# EAGLE design untitled (EAGLE 9.6.2)
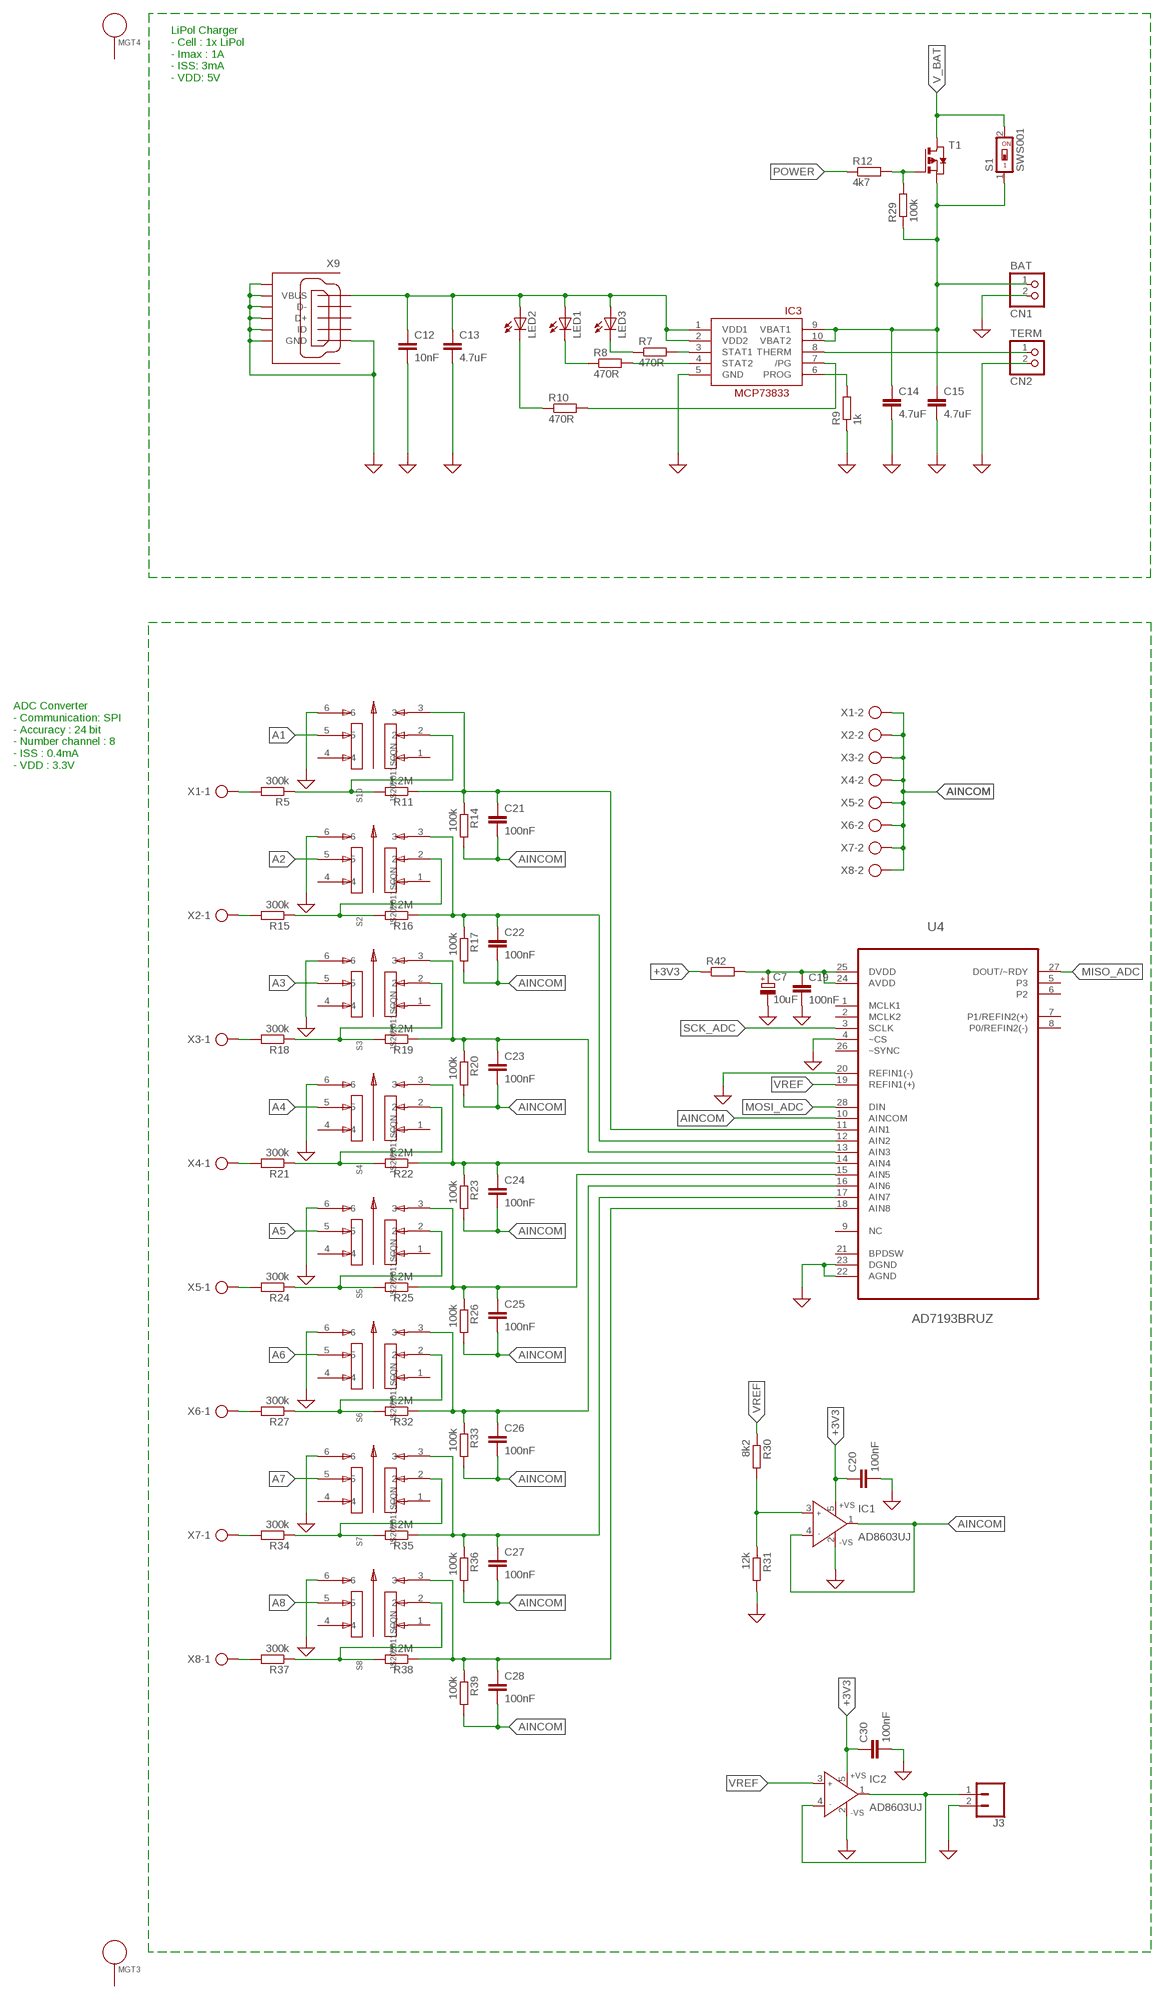
[diagram p0: schematic, sheet 1, part 1 of 2]
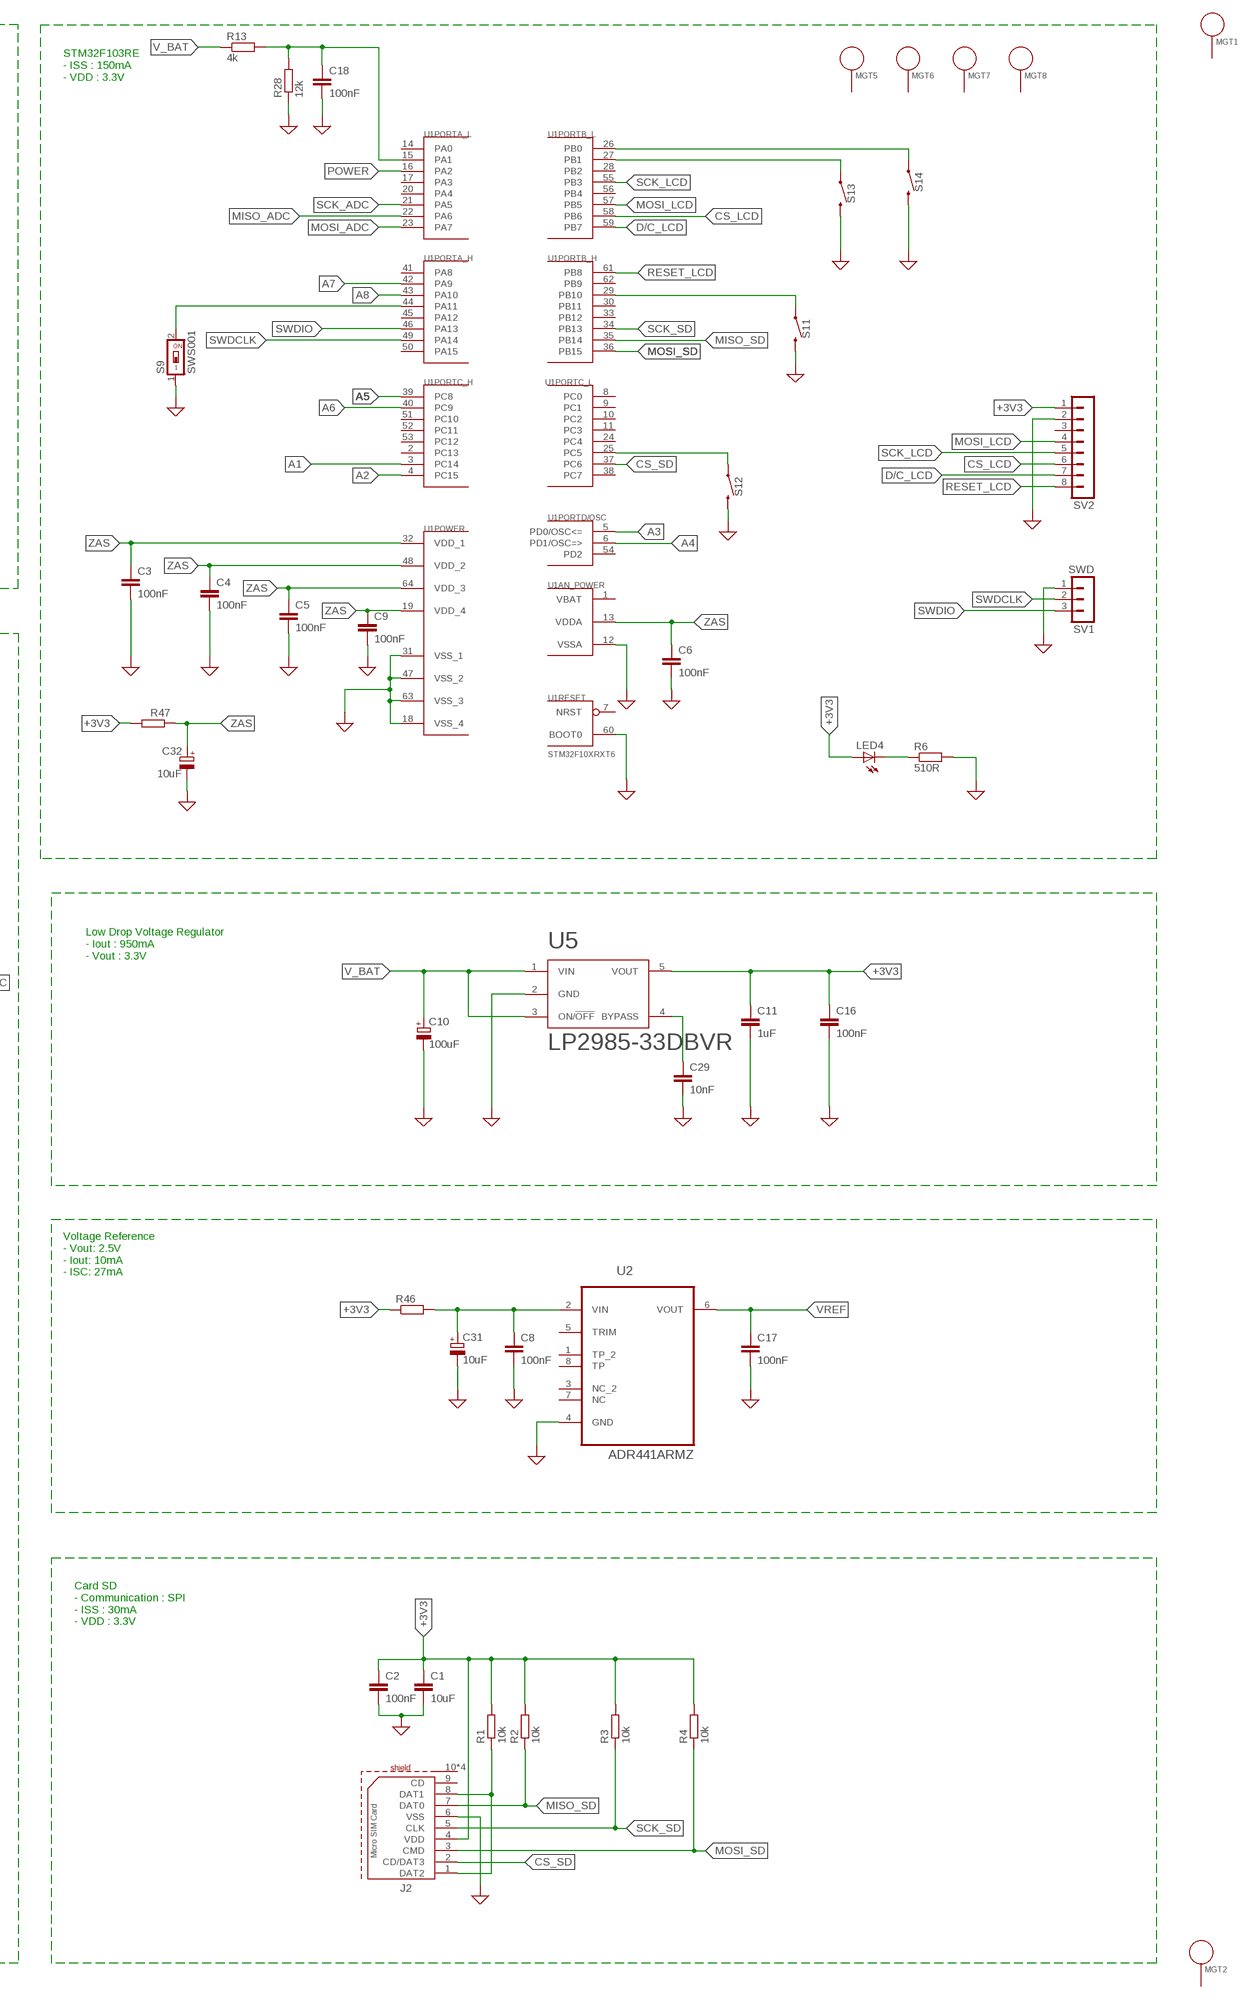
[diagram p1: schematic, sheet 1, part 2 of 2]

## Parts
C1  10uF  C-EUC0805  [C0805]
C2  100nF  C-EUC0805  [C0805]
C3  100nF  C-EUC0805  [C0805]
C4  100nF  C-EUC0805  [C0805]
C5  100nF  C-EUC0805  [C0805]
C6  100nF  C-EUC0805  [C0805]
C7  10uF  CPOL-EUSMCB  [SMC_B]
C8  100nF  C-EUC0805  [C0805]
C9  100nF  C-EUC0805  [C0805]
C10  100uF  CPOL-EUSMCB  [SMC_B]
C11  1uF  C-EUC0805  [C0805]
C12  10nF  C-EUC0805  [C0805]
C13  4.7uF  C-EUC0805  [C0805]
C14  4.7uF  C-EUC0805  [C0805]
C15  4.7uF  C-EUC0805  [C0805]
C16  100nF  C-EUC0805  [C0805]
C17  100nF  C-EUC0805  [C0805]
C18  100nF  C-EUC0805  [C0805]
C19  100nF  C-EUC0805  [C0805]
C20  100nF  C-EUC0805  [C0805]
C21  100nF  C-EUC0805  [C0805]
C22  100nF  C-EUC0805  [C0805]
C23  100nF  C-EUC0805  [C0805]
C24  100nF  C-EUC0805  [C0805]
C25  100nF  C-EUC0805  [C0805]
C26  100nF  C-EUC0805  [C0805]
C27  100nF  C-EUC0805  [C0805]
C28  100nF  C-EUC0805  [C0805]
C29  10nF  C-EUC0805  [C0805]
C30  100nF  C-EUC0805  [C0805]
C31  10uF  CPOL-EUSMCB  [SMC_B]
C32  10uF  CPOL-EUSMCB  [SMC_B]
CN1  BAT  JST_2PIN-THM-RA  [JST-PH-2-THM-RA]
CN2  TERM  JST_2PIN-THM-RA  [JST-PH-2-THM-RA]
IC1  AD8603UJ  [SOT23-5]
IC2  AD8603UJ  [SOT23-5]
IC3  MCP73833-UN  [MSOP10]
J2  693071020811  [693071020811]
J3  CONN_02PTH3  [1X02_LONGPADS]
LED1  LEDCHIP-LED0805  [CHIP-LED0805]
LED2  LEDCHIP-LED0805  [CHIP-LED0805]
LED3  LEDCHIP-LED0805  [CHIP-LED0805]
LED4  LEDCHIP-LED0805  [CHIP-LED0805]
MGT1  MOUNTING_HOLE  [BEAGLEBONEBLACK_MOUNTING_HOLE]
MGT2  MOUNTING_HOLE  [BEAGLEBONEBLACK_MOUNTING_HOLE]
MGT3  MOUNTING_HOLE  [BEAGLEBONEBLACK_MOUNTING_HOLE]
MGT4  MOUNTING_HOLE  [BEAGLEBONEBLACK_MOUNTING_HOLE]
MGT5  MOUNTING_HOLE  [BEAGLEBONEBLACK_MOUNTING_HOLE]
MGT6  MOUNTING_HOLE  [BEAGLEBONEBLACK_MOUNTING_HOLE]
MGT7  MOUNTING_HOLE  [BEAGLEBONEBLACK_MOUNTING_HOLE]
MGT8  MOUNTING_HOLE  [BEAGLEBONEBLACK_MOUNTING_HOLE]
R1  10k  R-EU_R0805  [R0805]
R2  10k  R-EU_R0805  [R0805]
R3  10k  R-EU_R0805  [R0805]
R4  10k  R-EU_R0805  [R0805]
R5  300k  R-EU_R0805  [R0805]
R6  510R  R-EU_R0805  [R0805]
R7  470R  R-EU_R0805  [R0805]
R8  470R  R-EU_R0805  [R0805]
R9  1k  R-EU_R0805  [R0805]
R10  470R  R-EU_R0805  [R0805]
R11  1.2M  R-EU_R0805  [R0805]
R12  4k7  R-EU_R0805  [R0805]
R13  4k  R-EU_R0805  [R0805]
R14  100k  R-EU_R0805  [R0805]
R15  300k  R-EU_R0805  [R0805]
R16  1.2M  R-EU_R0805  [R0805]
R17  100k  R-EU_R0805  [R0805]
R18  300k  R-EU_R0805  [R0805]
R19  1.2M  R-EU_R0805  [R0805]
R20  100k  R-EU_R0805  [R0805]
R21  300k  R-EU_R0805  [R0805]
R22  1.2M  R-EU_R0805  [R0805]
R23  100k  R-EU_R0805  [R0805]
R24  300k  R-EU_R0805  [R0805]
R25  1.2M  R-EU_R0805  [R0805]
R26  100k  R-EU_R0805  [R0805]
R27  300k  R-EU_R0805  [R0805]
R28  12k  R-EU_R0805  [R0805]
R29  100k  R-EU_R0805  [R0805]
R30  8k2  R-EU_R0805  [R0805]
R31  12k  R-EU_R0805  [R0805]
R32  1.2M  R-EU_R0805  [R0805]
R33  100k  R-EU_R0805  [R0805]
R34  300k  R-EU_R0805  [R0805]
R35  1.2M  R-EU_R0805  [R0805]
R36  100k  R-EU_R0805  [R0805]
R37  300k  R-EU_R0805  [R0805]
R38  1.2M  R-EU_R0805  [R0805]
R39  100k  R-EU_R0805  [R0805]
R42  R-EU_R1206  [R1206]
R46  R-EU_R1206  [R1206]
R47  R-EU_R1206  [R1206]
S1  SWS001  [SMS-001]
S2  JS202011SCQN  [SW_JS202011SCQN]
S3  JS202011SCQN  [SW_JS202011SCQN]
S4  JS202011SCQN  [SW_JS202011SCQN]
S5  JS202011SCQN  [SW_JS202011SCQN]
S6  JS202011SCQN  [SW_JS202011SCQN]
S7  JS202011SCQN  [SW_JS202011SCQN]
S8  JS202011SCQN  [SW_JS202011SCQN]
S9  SWS001  [SMS-001]
S10  JS202011SCQN  [SW_JS202011SCQN]
S11  MOMENTARY-SWITCH-SPST-SMD-6.2MM-TALL  [TACTILE_SWITCH_SMD_6.2MM_TALL]
S12  MOMENTARY-SWITCH-SPST-SMD-6.2MM-TALL  [TACTILE_SWITCH_SMD_6.2MM_TALL]
S13  MOMENTARY-SWITCH-SPST-SMD-6.2MM-TALL  [TACTILE_SWITCH_SMD_6.2MM_TALL]
S14  MOMENTARY-SWITCH-SPST-SMD-6.2MM-TALL  [TACTILE_SWITCH_SMD_6.2MM_TALL]
SV1  SWD  MA03-1  [MA03-1]
SV2  MA08-1  [MA08-1]
T1  PMOSSOT223  [SOT223]
U1  STM32F10XRXT6  [TQFP64]
U2  ADR441ARMZ  [SOP65P490X110-8N]
U4  AD7193BRUZ  [SOP65P640X120-28N]
U5  LP2985-33DBVR  [SOT-23-5]
X1  AK300/2  [AK300/2]
X2  AK300/2  [AK300/2]
X3  AK300/2  [AK300/2]
X4  AK300/2  [AK300/2]
X5  AK300/2  [AK300/2]
X6  AK300/2  [AK300/2]
X7  AK300/2  [AK300/2]
X8  AK300/2  [AK300/2]
X9  GHI-CONNECTORS_10118192-0001LF  [GHI-CONNECTORS_10118192-0001LF(MICRO-USB-B-AMPHENOL-FCI)]

## Nets
+3V3: C1.1 C2.1 C11.1 C16.1 C20.1 C30.1 IC1.5(+VS) IC2.5(+VS) J2.4(VDD) LED4.A R1.2 R2.2 R3.2 R4.2 R42.1 R46.1 R47.2 SV2.1 U5.5(VOUT)
A1: S10.5 U1.3(PORTC_H:PC14)
A2: S2.5 U1.4(PORTC_H:PC15)
A3: S3.5 U1.5(PORTD/OSC:PD0/OSC<=)
A4: S4.5 U1.6(PORTD/OSC:PD1/OSC=>)
A5: S5.5 U1.39(PORTC_H:PC8)
A6: S6.5 U1.40(PORTC_H:PC9)
A7: S7.5 U1.42(PORTA_H:PA9)
A8: S8.5 U1.43(PORTA_H:PA10)
AINCOM: C21.2 C22.2 C23.2 C24.2 C25.2 C26.2 C27.2 C28.2 IC1.1(OUT) IC1.4(IN-) R14.2 R17.2 R20.2 R23.2 R26.2 R33.2 R36.2 R39.2 U4.10(AINCOM) X1.2 X2.2 X3.2 X4.2 X5.2 X6.2 X7.2 X8.2
CS_LCD: SV2.6 U1.58(PORTB_L:PB6)
CS_SD: J2.2(CD/DAT3) U1.37(PORTC_L:PC6)
D/C_LCD: SV2.7 U1.59(PORTB_L:PB7)
GND: C1.2 C2.2 C3.2 C4.2 C5.2 C6.2 C7.- C8.2 C9.2 C10.- C11.2 C12.2 C13.2 C14.2 C15.2 C16.2 C17.2 C18.2 C19.2 C20.2 C29.2 C30.2 C31.- C32.- CN1.2 CN2.2 IC1.2(-VS) IC2.2(-VS) IC3.5(GND) J2.6(VSS) J3.2 R6.2 R9.1 R28.1 R31.2 S2.6 S3.6 S4.6 S5.6 S6.6 S7.6 S8.6 S9.1 S10.6 S11.B2 S12.B2 S13.B2 S14.B2 SV1.1 SV2.2 U1.12(AN_POWER:VSSA) U1.18(POWER:VSS_4) U1.31(POWER:VSS_1) U1.47(POWER:VSS_2) U1.60(RESET:BOOT0) U1.63(POWER:VSS_3) U2.4(GND) U4.4(~CS) U4.20(REFIN1(-)) U4.22(AGND) U4.23(DGND) U5.2(GND) X9.CGND1(SGND1) X9.CGND2(SGND2) X9.CGND3(SGND3) X9.CGND4(SGND4) X9.CGND5(SGND5) X9.CGND6(SGND6) X9.GND ; supply symbol labelled SUP
MISO_ADC: U1.22(PORTA_L:PA6) U4.27(DOUT/~RDY)
MISO_SD: J2.7(DAT0) R2.1 U1.35(PORTB_H:PB14)
MOSI_ADC: U1.23(PORTA_L:PA7) U4.28(DIN)
MOSI_LCD: SV2.4 U1.57(PORTB_L:PB5)
MOSI_SD: J2.3(CMD) R4.1 U1.36(PORTB_H:PB15)
N$1: J2.1(DAT2) J2.8(DAT1) R1.1
N$3: LED4.C R6.1
N$4: C22.1 R16.1 R17.1 S2.3 U4.12(AIN2)
N$5: R5.2 X1.1
N$8: IC3.3(STAT1) R7.2
N$9: IC3.6(PROG) R9.2
N$10: IC3.7(/PG) R10.2
N$11: LED3.C R7.1
N$12: LED1.C R8.1
N$13: IC3.4(STAT2) R8.2
N$14: LED2.C R10.1
N$15: CN2.1 IC3.8(THERM)
N$16: C12.1 C13.1 IC3.1(VDD1) IC3.2(VDD2) LED1.A LED2.A LED3.A X9.VBUS
N$17: C21.1 R11.1 R14.1 S10.3 U4.11(AIN1)
N$18: R15.1 R16.2 S2.2
N$19: C29.1 U5.4(BYPASS)
N$20: R5.1 R11.2 S10.2
N$21: R21.1 R22.2 S4.2
N$22: C26.1 R32.1 R33.1 S6.3 U4.16(AIN6)
N$23: C27.1 R35.1 R36.1 S7.3 U4.17(AIN7)
N$24: R15.2 X2.1
N$25: C18.1 R13.2 R28.2 U1.15(PORTA_L:PA1)
N$29: C23.1 R19.1 R20.1 S3.3 U4.13(AIN3)
N$30: IC2.1(OUT) IC2.4(IN-) J3.1
N$31: C7.+ C19.1 R42.2 U4.24(AVDD) U4.25(DVDD)
N$32: R18.2 X3.1
N$33: C14.1 C15.1 CN1.1 IC3.9(VBAT1) IC3.10(VBAT2) R29.1 S1.1 T1.3(S)
N$34: R18.1 R19.2 S3.2
N$35: IC1.3(IN+) R30.2 R31.1
N$36: S11.A2 U1.29(PORTB_H:PB10)
N$37: C24.1 R22.1 R23.1 S4.3 U4.14(AIN4)
N$39: C25.1 R25.1 R26.1 S5.3 U4.15(AIN5)
N$40: R21.2 X4.1
N$43: S14.A2 U1.26(PORTB_L:PB0)
N$44: R24.2 X5.1
N$46: R24.1 R25.2 S5.2
N$47: S13.A2 U1.27(PORTB_L:PB1)
N$48: R12.2 R29.2 T1.1(G)
N$49: S9.2 U1.44(PORTA_H:PA11)
N$50: R27.2 X6.1
N$51: R27.1 R32.2 S6.2
N$52: S12.A2 U1.25(PORTC_L:PC5)
N$54: R34.2 X7.1
N$55: R34.1 R35.2 S7.2
N$56: C28.1 R38.1 R39.1 S8.3 U4.18(AIN8)
N$58: R37.2 X8.1
N$59: R37.1 R38.2 S8.2
N$60: C8.1 C31.+ R46.2 U2.2(VIN)
POWER: R12.1 U1.16(PORTA_L:PA2)
RESET_LCD: SV2.8 U1.61(PORTB_H:PB8)
SCK_ADC: U1.21(PORTA_L:PA5) U4.3(SCLK)
SCK_LCD: SV2.5 U1.55(PORTB_L:PB3)
SCK_SD: J2.5(CLK) R3.1 U1.34(PORTB_H:PB13)
SWDCLK: SV1.2 U1.49(PORTA_H:PA14)
SWDIO: SV1.3 U1.46(PORTA_H:PA13)
V_BAT: C10.+ R13.1 S1.2 T1.2(D) T1.4(D) U5.1(VIN) U5.3(ON/!OFF!)
VREF: C17.1 IC2.3(IN+) R30.1 U2.6(VOUT) U4.19(REFIN1(+))
ZAS: C3.1 C4.1 C5.1 C6.1 C9.1 C32.+ R47.1 U1.13(AN_POWER:VDDA) U1.19(POWER:VDD_4) U1.32(POWER:VDD_1) U1.48(POWER:VDD_2) U1.64(POWER:VDD_3)
Unconnected: J2.9(CD) J2.10(SHIELD) J2.11(SHIELD) J2.12(SHIELD) J2.13(SHIELD) MGT1.P$1 MGT2.P$1 MGT3.P$1 MGT4.P$1 MGT5.P$1 MGT6.P$1 MGT7.P$1 MGT8.P$1 S2.1 S2.4 S3.1 S3.4 S4.1 S4.4 S5.1 S5.4 S6.1 S6.4 S7.1 S7.4 S8.1 S8.4 S10.1 S10.4 SV2.3 U1.2(PORTC_H:PC13) U1.7(RESET:NRST) U1.8(PORTC_L:PC0) U1.9(PORTC_L:PC1) U1.10(PORTC_L:PC2) U1.11(PORTC_L:PC3) U1.14(PORTA_L:PA0) U1.17(PORTA_L:PA3) U1.20(PORTA_L:PA4) U1.24(PORTC_L:PC4) U1.28(PORTB_L:PB2) U1.30(PORTB_H:PB11) U1.33(PORTB_H:PB12) U1.38(PORTC_L:PC7) U1.41(PORTA_H:PA8) U1.45(PORTA_H:PA12) U1.50(PORTA_H:PA15) U1.51(PORTC_H:PC10) U1.52(PORTC_H:PC11) U1.53(PORTC_H:PC12) U1.54(PORTD/OSC:PD2) U1.56(PORTB_L:PB4) U1.62(PORTB_H:PB9) U2.1(TP_2) U2.3(NC_2) U2.5(TRIM) U2.7(NC) U2.8(TP) U4.1(MCLK1) U4.2(MCLK2) U4.5(P3) U4.6(P2) U4.7(P1/REFIN2(+)) U4.8(P0/REFIN2(-)) U4.9(NC) U4.21(BPDSW) U4.26(~SYNC) X9.D+ X9.D- X9.ID

## Notes on the sheet
- STM32F103RE
  - ISS : 150mA
  - VDD : 3.3V
- LiPol Charger
  - Cell : 1x LiPol
  - Imax : 1A
  - ISS: 3mA
  - VDD: 5V
- ADC Converter
  - Communication: SPI
  - Accuracy : 24 bit
  - Number channel : 8
  - ISS : 0.4mA
  - VDD : 3.3V
- Low Drop Voltage Regulator
  - Iout : 950mA
  - Vout : 3.3V
- Voltage Reference
  - Vout: 2.5V
  - Iout: 10mA
  - ISC: 27mA
- Card SD
  - Communication : SPI
  - ISS : 30mA
  - VDD : 3.3V

## Power pins joined to a net without a drawn wire
VBAT: U1.1(AN_POWER:VBAT)

## Library data of the parts
C1-C6 C8 C9 C11-C30 = rcl:C-EU: CAPACITOR, European symbol; SPICEPREFIX: C
C7 C10 C31 C32 = rcl:CPOL-EU: POLARIZED CAPACITOR, European symbol; SPICEPREFIX: C
CN1 CN2 = adafruit:JST_2PIN: JST 2-Pin Connectors of various flavors SMT-RA (S2B-PH-SM4) 4UConnector #17311 SMT (B2B-PH-SM4) THM-RA (S2B-PH) THM (B2B-PH)
IC1 IC2 = analog-devices:AD8603: Precision Micropower, Low Noise CMOS, Rail-to-Rail Input/Output Operational Amplifiers Source: http://www.analog.com/static/imported-files/data_sheets/AD8603_8607_8609.pdf; MF: ALTERA CORPORATION; MPN: AD8603AUJZ-REEL7; OC_FARNELL: 1651290; OC_NEWARK: 59K6904
IC3 = adafruit:MCP73833
J2 = Wurth_Connectors_WR-CRD:693071020811: WR-CRD Micro SD Card Connector Push & Push 8 pins KIND PROPERTIES Quality Class 10 000 Mating cycles Gender Socket Type Push & Push MATERIAL PROPERTIES Insulator Material LCP Insulator Flammability Rating UL94 V-0 Insulator Color Black Color Black Cover Material Stainless Steel Contact Material Copper Alloy Contact Plating Selective Gold;​ 1 u' on contact area Contact Type Stamped GENERAL INFORMATION Operating Temperature -25 up to +85 °C;​ -40 up to +85 °C Compliance RoHS ELECTRICAL PROPERTIES Working Voltage 100 V (AC);​ 30 V (AC) Withstanding Voltage 500 V (AC) Contact Resistance 100 mΩ Contact Resistance 500 mΩ Details see: https://katalog.we-online.com/en/em/CRD_SD_MICRO_PUSH_AND_PULL_8_PINS Created by Ella Wu 2019-11-05 2019(C) Wurth Elektronik; DATASHEET-URL: https://www.we-online.com/catalog/datasheet/693071020811.pdf; GERDER: Socket; MOUNT: SMT; PART-NUMBER: 693071020811; PINS: 8; TYPE: Push & Push
J3 = SparkFun-Connectors:CONN_02: Multi connection point. Often used as Generic Header-pin footprint for 0.1 inch spaced/style header connections On any of the 0.1 inch spaced packages, you can populate with these: Break Away Headers - Straight <https://www.sparkfun.com/products/116> (PRT-00116) Break Away Male Headers - Right Angle <https://www.sparkfun.com/products/553> (PRT-00553) Female Headers <https://www.sparkfun.com/products/115> (PRT-00115) Break Away Headers - Machine Pin <https://www.sparkfun.com/products/117> (PRT-00117) Break Away Female Headers - Swiss Machine Pin <https://www.sparkfun.com/products/743> (PRT-00743) For SCREWTERMINALS and SPRING TERMINALS visit here: Screw Terimnals on SparkFun.com <https://www.sparkfun.com/search/results?term=Screw+Terminals> (5mm/3.5mm/2.54mm spacing) This device is also useful as a general connection point to wire up your design to another part of your project. Our various solder wires solder well into these plated through hole pads. Hook-Up Wire - Assortment (Stranded, 22 AWG) <https://www.sparkfun.com/products/11375> (PRT-11375) Hook-Up Wire - Assortment (Solid Core, 22 AWG) <https://www.sparkfun.com/products/11367> (PRT-11367) View the entire wire category on our website here <https://www.sparkfun.com/categories/141> Special notes: Molex polarized connector foot print use with: PRT-08233 with associated crimp pins and housings. 2.54_SCREWTERM for use with PRT-10571. 3.5mm Screw Terminal footprints for PRT-08084 5mm Screw Terminal footprints for use with PRT-08432
LED1-LED4 = adafruit:LED: LED OSRAM: - CHIPLED LG R971, LG N971, LY N971, LG Q971, LY Q971, LO R971, LY R971 LH N974, LH R974 LS Q976, LO Q976, LY Q976 LO Q996 - Hyper CHIPLED LW Q18S LB Q993, LB Q99A, LB R99A - SideLED LS A670, LO A670, LY A670, LG A670, LP A670 LB A673, LV A673, LT A673, LW A673 LH A674 LY A675 LS A676, LA A676, LO A676, LY A676, LW A676 LS A679, LY A679, LG A679 - Hyper Micro SIDELED® LS Y876, LA Y876, LO Y876, LY Y876 LT Y87S - SmartLED LW L88C, LW L88S LB L89C, LB L89S, LG L890 LS L89K, LO L89K, LY L89K LS L896, LA L896, LO L896, LY L896 - TOPLED LS T670, LO T670, LY T670, LG T670, LP T670 LSG T670, LSP T670, LSY T670, LOP T670, LYG T670 LG T671, LOG T671, LSG T671 LB T673, LV T673, LT T673, LW T673 LH T674 LS T676, LA T676, LO T676, LY T676, LB T676, LH T676, LSB T676, LW T676 LB T67C, LV T67C, LT T67C, LS T67K, LO T67K, LY T67K, LW E67C LS E67B, LA E67B, LO E67B, LY E67B, LB E67C, LV E67C, LT E67C LW T67C LS T679, LY T679, LG T679 LS T770, LO T770, LY T770, LG T770, LP T770 LB T773, LV T773, LT T773, LW T773 LH T774 LS E675, LA E675, LY E675, LS T675 LS T776, LA T776, LO T776, LY T776, LB T776 LHGB T686 LT T68C, LB T68C - Hyper Mini TOPLED® LB M676 - Mini TOPLED Santana® LG M470 LS M47K, LO M47K, LY M47K Source: http://www.osram.convergy.de/
MGT1-MGT8 = BeagleBone_Blue_R3:MOUNTING_HOLE: Chassis Mounting Hole w/GND connection ability
R1-R39 R42 R46 R47 = rcl:R-EU_: RESISTOR, European symbol; SPICEPREFIX: R
S1 S9 = smd-special:SWS001: SMD Dip Switch 1 pol.
S2-S8 S10 = JS202011SCQN:JS202011SCQN: JS Series DPDT On-On Gull Wing Surface Mount Subminiature Slide Switch Check prices <https://pricing.snapeda.com/parts/JS202011SCQN/C%26K/view-part?ref=eda>; AVAILABILITY: Good; DESCRIPTION: Slide Switch DPDT Surface Mount; MF: C&K; MP: JS202011SCQN; PACKAGE: None; PRICE: None; PURCHASE-URL: https://pricing.snapeda.com/search/part/JS202011SCQN/?ref=eda
S11-S14 = SparkFun-Switches:MOMENTARY-SWITCH-SPST: Momentary Switch (Pushbutton) - SPST Normally-open (NO) SPST momentary switches (buttons, pushbuttons). Variants PTH-12MM - 12mm square, through-hole Momentary Pushbutton Switch - 12mm Square <https://www.sparkfun.com/products/9190> (COM-09190) PTH-6.0MM, PTH-6.0MM-KIT - 6.0mm square, through-hole Mini Pushbutton Switch <https://www.sparkfun.com/products/97> (COM-00097) KIT package intended for soldering kit's - only one side of pads' copper is exposed. PTH-RIGHT-ANGLE-KIT - Right-angle, through-hole Right Angle Tactile Button <https://www.sparkfun.com/products/10791> - Used on SparkFun BigTime Watch Kit <https://www.sparkfun.com/products/11734> SMD-12MM - 12mm square, surface-mount Tactile Button - SMD (12mm) <https://www.sparkfun.com/products/12993> (COM-12993) Used on SparkFun PicoBoard <https://www.sparkfun.com/products/11888> SMD-4.5MM - 4.5mm Square Trackball Switch Used on SparkFun Blackberry Trackballer Breakout <https://www.sparkfun.com/products/13169> SMD-4.6MMX2.8MM - 4.60mm x 2.80mm, surface mount Used on SparkFun SAMD21 Mini Breakout <https://www.sparkfun.com/products/13664> SMD-5.2MM, SMD-5.2-REDUNDANT - 5.2mm square, surface-mount Mini Pushbutton Switch - SMD <https://www.sparkfun.com/products/8720> (COM-08720) Used on Arduino Pro Mini <https://www.sparkfun.com/products/11114> REDUNDANT package connects both switch circuits together SMD-6.0X3.5MM - 6.0 x 3.5mm, surface mount Momentary Reset Switch SMD <https://www.sparkfun.com/products/8229> (COM-08229) SMD-6.2MM-TALL - 6.2mm square, surface mount Tactile Button - SMD (6mm) <https://www.sparkfun.com/products/12992> Used on SparkFun Digital Sandbox <https://www.sparkfun.com/products/12651> SMD-RIGHT-ANGLE - Right-angle, surface mount Used on SparkFun Block for Intel® Edison - Arduino <https://www.sparkfun.com/products/13036>; PROD_ID: SWCH-11966; SF_SKU: COM-12992
SV1 = con-lstb:MA03-1: PIN HEADER; OC_FARNELL: unknown; OC_NEWARK: unknown
SV2 = con-lstb:MA08-1: PIN HEADER; OC_FARNELL: unknown; OC_NEWARK: unknown
T1 = zetex:PMOSSOT223: MOS FET; OC_FARNELL: unknown; OC_NEWARK: unknown
U1 = stm32:STM32F10XRXT6: STM32F101/103 64pin LQFP
U2 = ADR441ARMZ:ADR441ARMZ: Ultralow Noise, LDO XFET Voltage Check prices <https://pricing.snapeda.com/parts/ADR441ARMZ/Analog%20Devices/view-part?ref=eda>; AVAILABILITY: Warning; DESCRIPTION: Series Voltage Reference IC ±0.12% 8-MSOP; MF: Analog Devices; MP: ADR441ARMZ; PACKAGE: MSOP-8 Analog Devices; PRICE: None; PURCHASE-URL: https://pricing.snapeda.com/search/part/ADR441ARMZ/?ref=eda
U4 = AD7193BRUZ:AD7193BRUZ: 4-Channel, 4.8 kHz, Ultralow Noise, 24-Bit Sigma-Delta ADC with PGA Check prices <https://pricing.snapeda.com/parts/AD7193BRUZ/Analog%20Devices/view-part?ref=eda>; AVAILABILITY: Good; DESCRIPTION: 24 Bit Analog to Digital Converter 4, 8 Input 1 Sigma-Delta 28-TSSOP; MF: Analog Devices; MP: AD7193BRUZ; PACKAGE: TSSOP -28 Analog Devices; PRICE: None; PURCHASE-URL: https://pricing.snapeda.com/search/part/AD7193BRUZ/?ref=eda
U5 = IC:LP2985-33DBVR: IC REG LINEAR 3.3V 150MA SOT23-5 Manufacturer's datasheet <http://www.ti.com/lit/ds/symlink/lp2985.pdf>; CREATED_BY: PCBLayout.com; DIGIKEY_PART_NUMBER: 296-18476-2-ND; MANUFACTURER: Texas Instruments; MPN: LP2985-33DBVR; PACKAGE: SOT-23-5
X1-X8 = con-ptr500:AK300/2: CONNECTOR; OC_FARNELL: unknown; OC_NEWARK: unknown
X9 = BeagleBone_Black_Wireless:GHI-CONNECTORS_10118192-0001LF: Amphenol FCI Micro USB Type B Complete Surface Mount (SMT) no guide holes

## Board
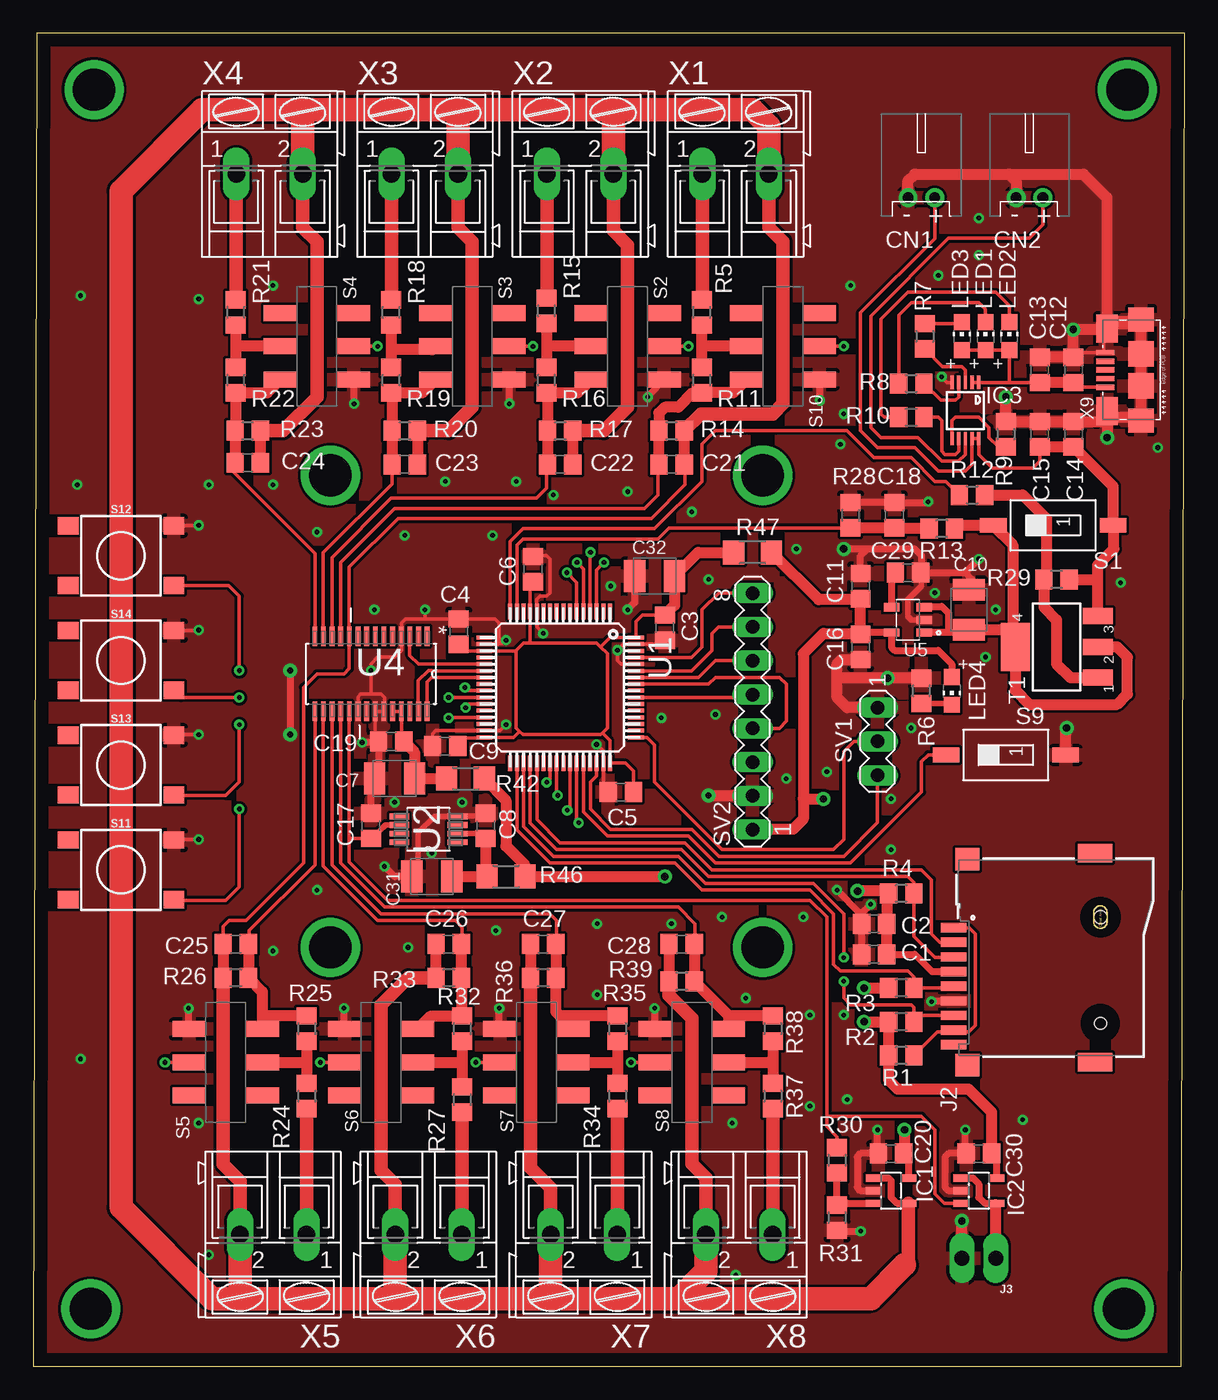
[diagram p2: board, top side]
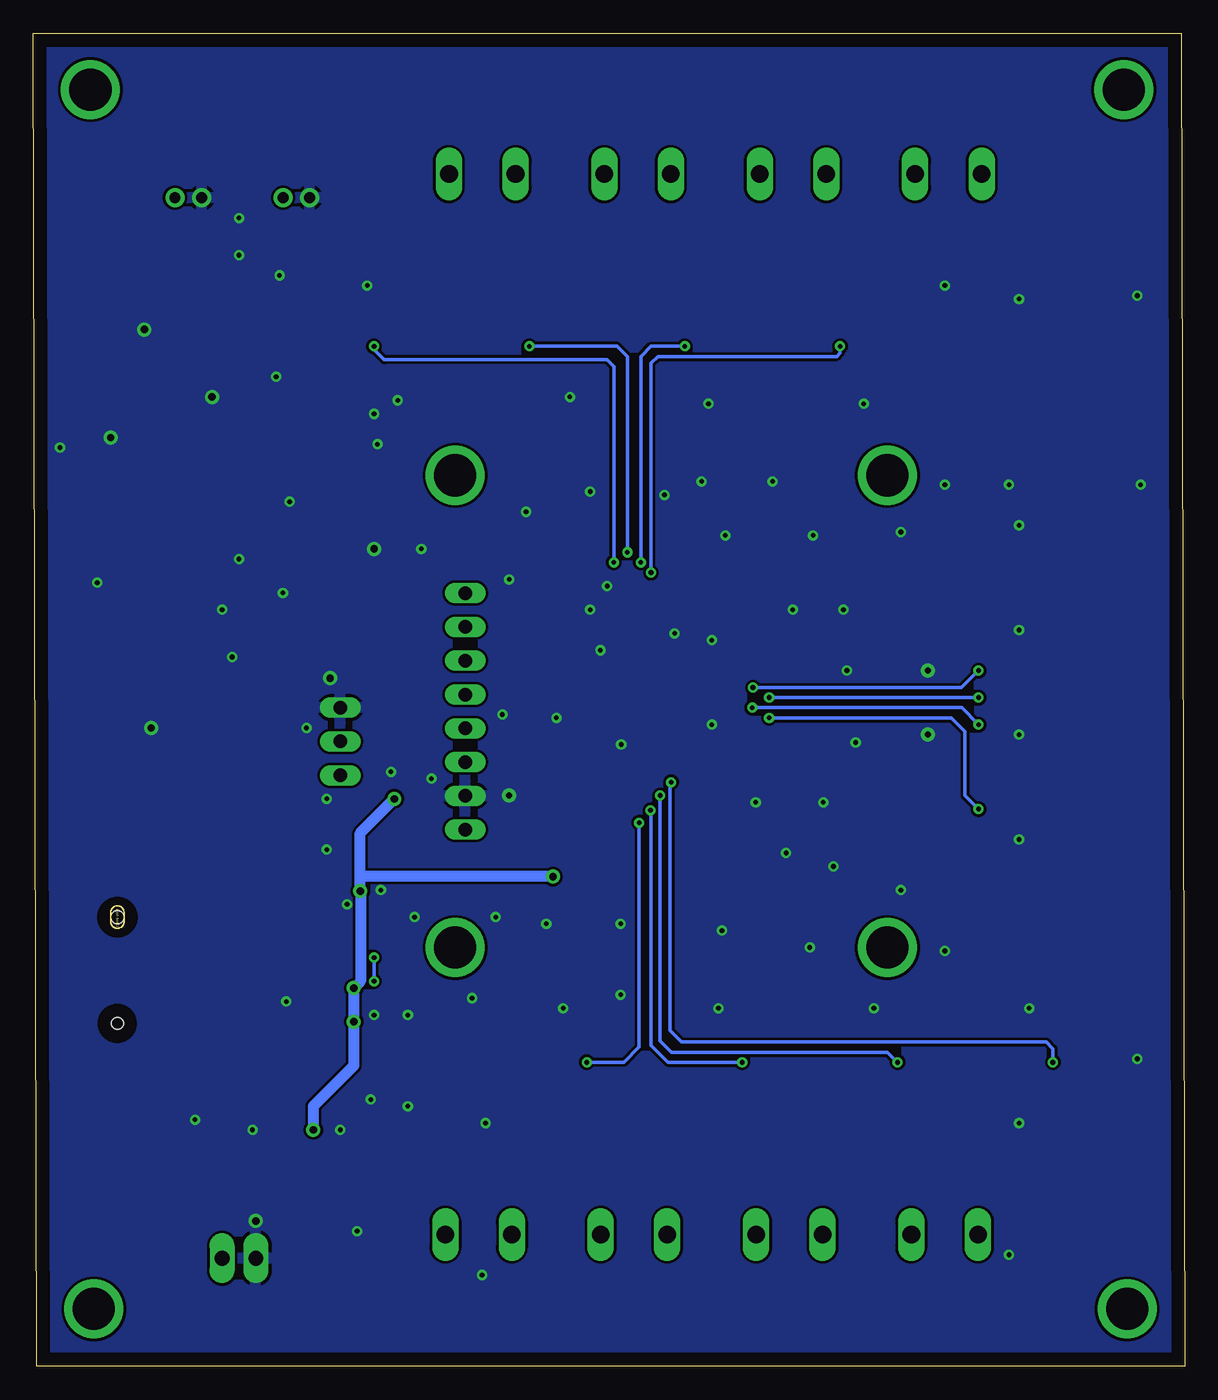
[diagram p3: board, bottom side, seen from below]

Size 86.59 x 100.25 mm. Coordinates in mm from the lower left corner, seen from the top.
Outline: 0,0 86.34,0 86.59,100.25 0.25,100.25 0,0
Copper layers (1*16): Top 0.035mm / dielectric 1.5mm / Bottom 0.035mm
Design rules "default *": minimum track width 8mil, minimum drill 0.35mm, track to track 8mil, track to pad 8mil, pad to pad 6mil, via to via 6mil, smd to smd 6mil, copper to edge 40mil, drill to drill 6mil, minimum pad ring 10mil, minimum via ring 8mil, stop-mask expansion 4mil, vias tented up to drill 0mil, thermal gap 10mil

### Footprints (pad centres in the part's own frame; a part is rotated, then mirrored left to right if it is on the bottom)
C0805 = smd 1.3 x 1.5: 1 -0.95,0; 2 0.95,0
SMC_B = smd 1.6 x 2.4: + -1.5,0; - 1.5,0
JST-PH-2-THM-RA = drill 0.8 pad 1.422: 1 1,0; 2 -1,0
SOT23-5 = smd 0.55 x 1.2: 1 -0.95,-1.3; 2 0,-1.3; 3 0.95,-1.3; 4 0.95,1.3; 5 -0.95,1.3
MSOP10 = smd 0.25 x 1: 1 -1,-2.113; 2 -0.5,-2.113; 3 0,-2.113; 4 0.5,-2.113; 5 1,-2.113; 6 1,2.113; 7 0.5,2.113; 8 0,2.113; 9 -0.5,2.113; 10 -1,2.113
693071020811 = smd 0.7 x 1.9: 1 2.25,11.05; 2 1.15,11.05; 3 0.05,11.05; 4 -1.05,11.05; 5 -2.15,11.05; 6 -3.25,11.05; 7 -4.35,11.05; 8 -5.45,11.05; 9 -6.55,11.05 | smd 1.7 x 1.8: 10 -8.1,10; 11 7.4,10 | smd 1.4 x 2.6: 12 -7.85,0.4; 13 7.85,0.4 | hole 0.9: -4.95,0 | hole 1: 3.05,0
1X02_LONGPADS = drill 1.118 pad 1.88 long: 1 0,0; 2 2.54,0
CHIP-LED0805 = smd 1.2 x 1.2: A 0,-1.05; C 0,1.05
BEAGLEBONEBLACK_MOUNTING_HOLE = drill 3.175 pad 4.445: P$1 0,0
R0805 = smd 1.3 x 1.5: 1 -0.95,0; 2 0.95,0
R1206 = smd 1.6 x 1.803: 1 -1.422,0; 2 1.422,0
SMS-001 = smd 1.092 x 2.007: 1 0,-4.496; 2 0,4.496
SW_JS202011SCQN = smd 1.2 x 2.5: 1 -2.5,-2.75; 2 0,-2.75; 3 2.5,-2.75; 4 -2.5,2.75; 5 0,2.75; 6 2.5,2.75
TACTILE_SWITCH_SMD_6.2MM_TALL = smd 1.55 x 1.3: A1 -3.975,-2.25; A2 3.975,-2.25; B1 -3.975,2.25; B2 3.975,2.25
MA03-1 = drill 1.016 long: 1 -2.54,0; 2 0,0; 3 2.54,0
MA08-1 = drill 1.016 long: 1 -8.89,0; 2 -6.35,0; 3 -3.81,0; 4 -1.27,0; 5 1.27,0; 6 3.81,0; 7 6.35,0; 8 8.89,0
SOT223 = smd 1.219 x 2.235: 1 -2.311,-3.099; 2 0,-3.099; 3 2.311,-3.099 | smd 3.6 x 2.2: 4 0,3.099
TQFP64 = smd 1.2 x 0.3: 1 -5.7,3.75; 2 -5.7,3.25; 3 -5.7,2.75; 4 -5.7,2.25; 5 -5.7,1.75; 6 -5.7,1.25; 7 -5.7,0.75; 8 -5.7,0.25; 9 -5.7,-0.25; 10 -5.7,-0.75; 11 -5.7,-1.25; 12 -5.7,-1.75; 13 -5.7,-2.25; 14 -5.7,-2.75; 15 -5.7,-3.25; 16 -5.7,-3.75; 33 5.7,-3.75; 34 5.7,-3.25; 35 5.7,-2.75; 36 5.7,-2.25; 37 5.7,-1.75; 38 5.7,-1.25; 39 5.7,-0.75; 40 5.7,-0.25; 41 5.7,0.25; 42 5.7,0.75; 43 5.7,1.25; 44 5.7,1.75; 45 5.7,2.25; 46 5.7,2.75; 47 5.7,3.25; 48 5.7,3.75 | smd 0.3 x 1.2: 17 -3.75,-5.7; 18 -3.25,-5.7; 19 -2.75,-5.7; 20 -2.25,-5.7; 21 -1.75,-5.7; 22 -1.25,-5.7; 23 -0.75,-5.7; 24 -0.25,-5.7; 25 0.25,-5.7; 26 0.75,-5.7; 27 1.25,-5.7; 28 1.75,-5.7; 29 2.25,-5.7; 30 2.75,-5.7; 31 3.25,-5.7; 32 3.75,-5.7; 49 3.75,5.7; 50 3.25,5.7; 51 2.75,5.7; 52 2.25,5.7; 53 1.75,5.7; 54 1.25,5.7; 55 0.75,5.7; 56 0.25,5.7; 57 -0.25,5.7; 58 -0.75,5.7; 59 -1.25,5.7; 60 -1.75,5.7; 61 -2.25,5.7; 62 -2.75,5.7; 63 -3.25,5.7; 64 -3.75,5.7
SOP65P490X110-8N = smd 1.499 x 0.432: 1 -2.184,0.965; 2 -2.184,0.33; 3 -2.184,-0.33; 4 -2.184,-0.965; 5 2.184,-0.965; 6 2.184,-0.33; 7 2.184,0.33; 8 2.184,0.965
SOP65P640X120-28N = smd 1.473 x 0.356: 1 -2.819,4.216; 2 -2.819,3.581; 3 -2.819,2.921; 4 -2.819,2.286; 5 -2.819,1.626; 6 -2.819,0.965; 7 -2.819,0.33; 8 -2.819,-0.33; 9 -2.819,-0.965; 10 -2.819,-1.626; 11 -2.819,-2.286; 12 -2.819,-2.921; 13 -2.819,-3.581; 14 -2.819,-4.216; 15 2.819,-4.216; 16 2.819,-3.581; 17 2.819,-2.921; 18 2.819,-2.286; 19 2.819,-1.626; 20 2.819,-0.965; 21 2.819,-0.33; 22 2.819,0.33; 23 2.819,0.965; 24 2.819,1.626; 25 2.819,2.286; 26 2.819,2.921; 27 2.819,3.581; 28 2.819,4.216
SOT-23-5 = smd 1.16 x 0.61: 1 -1.23,0.95; 2 -1.23,0; 3 -1.23,-0.95; 4 1.23,-0.95; 5 1.23,0.95
AK300/2 = drill 1.321 long: 1 -2.515,0; 2 2.489,0
GHI-CONNECTORS_10118192-0001LF(MICRO-USB-B-AMPHENOL-FCI) = smd 1.8 x 1.9: CGND1 -3.8,0; CGND4 3.8,0 | smd 1.9 x 1.9: CGND2 -1.2,0; CGND3 1.2,0 | smd 2.1 x 1.6: CGND5 3.1,2.55; CGND6 -3.1,2.55 | smd 0.4 x 1.35: D+ 0,2.675; D- -0.65,2.675; GND 1.3,2.675; ID 0.65,2.675; VBUS -1.3,2.675

### Placement (x,y rotation side)
C1  63.25,30.99 180 top
C2  63.25,33.27 180 top
C3  47.5,55.55 270 top
C4  32,55.25 90 top
C5  44.2,43.18 180 top
C6  37.59,59.94 90 top
C7  27.18,44.2 180 top
C8  34.04,40.64 90 top
C9  30.99,46.63 180 top
C10  70.36,56.9 90 top
C11  62.23,58.67 90 top
C12  78.23,74.93 90 top
C13  75.69,74.93 90 top
C14  78.23,70.1 90 top
C15  75.69,70.1 90 top
C16  62.23,54.1 270 top
C17  25.4,40.64 90 top
C18  64.77,64.01 90 top
C19  26.92,46.99 180 top
C20  64.52,16 180 top
C21  48.01,67.82 0 top
C22  39.62,67.82 0 top
C23  27.94,67.82 0 top
C24  16.13,67.94 0 top
C25  15.24,31.75 180 top
C26  31.24,31.75 180 top
C27  38.35,31.75 180 top
C28  48.77,31.75 180 top
C29  65.79,59.69 0 top
C30  71.12,16 180 top
C31  29.97,36.83 180 top
C32  46.74,59.44 180 top
CN1  66.8,87.88 0 top
CN2  74.93,87.88 0 top
IC1  64.52,13.21 270 top
IC2  71.12,13.21 270 top
IC3  70.1,71.88 180 top
J2  80.26,30.73 90 top
J3  72.39,8.13 180 top
LED1  71.63,77.47 0 top
LED2  73.41,77.47 0 top
LED3  69.85,77.47 0 top
LED4  69.09,50.8 180 top
MGT1  4.57,96.01 0 top
MGT2  4.32,4.32 0 top
MGT3  82.04,4.32 0 top
MGT4  82.3,96.01 0 top
MGT5  22.35,67.01 90 top
MGT6  22.35,31.5 90 top
MGT7  54.86,67.01 90 top
MGT8  54.86,31.5 90 top
R1  65.28,23.37 180 top
R2  65.28,25.91 180 top
R3  65.28,28.45 180 top
R4  65.28,35.56 180 top
R5  50.29,79.25 90 top
R6  66.8,50.8 90 top
R7  67.06,77.47 270 top
R8  66.04,73.91 0 top
R9  73.15,70.1 270 top
R10  66.04,71.37 0 top
R11  50.29,74.17 90 top
R12  70.61,65.53 0 top
R13  68.33,62.99 180 top
R14  48.01,70.36 0 top
R15  38.61,79.38 90 top
R16  38.61,74.17 90 top
R17  39.62,70.36 0 top
R18  26.92,79.25 90 top
R19  26.92,74.17 90 top
R20  27.94,70.36 0 top
R21  15.24,79.25 90 top
R22  15.24,74.17 90 top
R23  16.13,70.36 0 top
R24  20.57,20.32 270 top
R25  20.57,25.4 270 top
R26  15.24,29.21 180 top
R27  32.26,20.07 270 top
R28  61.47,64.01 270 top
R29  76.96,59.18 180 top
R30  60.45,15.49 270 top
R31  60.45,11.18 270 top
R32  32.26,25.4 270 top
R33  31.24,29.21 180 top
R34  43.94,20.32 270 top
R35  43.94,25.4 270 top
R36  38.35,29.21 180 top
R37  55.63,20.32 270 top
R38  55.63,25.4 270 top
R39  48.77,28.96 180 top
R42  32.51,44.2 180 top
R46  35.56,36.83 180 top
R47  54.1,61.21 0 top
S1  76.71,63.25 90 top
S2  44.7,76.71 270 top
S3  33.02,76.71 270 top
S4  21.34,76.71 270 top
S5  14.48,22.86 90 top
S6  26.16,22.86 90 top
S7  37.85,22.86 90 top
S8  49.53,22.86 90 top
S9  73.15,45.97 90 top
S10  56.39,76.71 270 top
S11  6.6,37.34 0 top
S12  6.6,60.96 0 top
S13  6.6,45.21 0 top
S14  6.6,53.09 0 top
SV1  63.5,46.99 270 top
SV2  54.1,49.25 90 top
T1  76.96,54.1 90 top
U1  39.62,51.05 270 top
U2  29.72,40.39 180 top
U4  25.4,52.07 270 top
U5  65.79,56.13 180 top
X1  52.83,89.66 0 top
X2  41.15,89.66 0 top
X3  29.46,89.66 0 top
X4  17.78,89.66 0 top
X5  18.03,9.91 180 top
X6  29.72,9.91 180 top
X7  41.4,9.91 180 top
X8  53.09,9.91 180 top
X9  83.31,74.93 90 top

### Tracks (layer width: path | path; a pad name or v marks a point on that pad's centre or on a via)
+3V3  (via drill 0.55 pad 1.05)
  Top 0.406: C11.1 62.16,57.66
  Top 0.508: C1.1 66.29,30.99 67.6,29.68 J2.4 | 65.53,16.07 C20.1 65.82,15.65 IC1.5 | C16.1 62.36,55.18 U5.5 64.56,54.06 64.77,53.85 68.07,53.85 69.09,52.83 LED4.A | C30.1 72.42,15.65 IC2.5
  Top 0.813: R47.2 59.08,57.66 62.16,57.66 62.23,57.59 C16.1 62.16,55.12 59.44,55.12 57.91,53.59 57.91,42.67 | 57.91,42.67 57.91,41.15 57.15,40.39 54.13,40.39 SV2.1 | 57.91,42.67 v59.44,42.67 | v62,35.74 64.15,35.74 R4.2 64.2,35.43 C2.1 C1.1 | v62.48,28.45 R3.2 | v62.48,25.91 R2.2 R1.2 64.33,21.52 65.02,20.83 70.36,20.83 72.07,19.12 C30.1 | v65.53,17.78 65.53,16.07 | v47.5,36.83 R46.1 36.98,37.69 35.56,39.12 35.56,42.57 R42.1
  Bottom 0.813: v65.53,17.78 65.53,19.56 62.48,22.61 v62.48,25.91 v62.48,28.45 61.98,28.96 61.98,35.71 v62,35.74 62,36.83 | 62,36.83 62,40.11 v59.44,42.67 | v47.5,36.83 62,36.83
A1  (via drill 0.35 pad 0.55)
  Top 0.254: U1.3 42.37,59.9 v42.93,60.45 | S10.5 v60.96,76.71
  Bottom 0.254: v42.93,60.45 42.93,75.18 43.43,75.69 60.2,75.69 60.96,76.45 v60.96,76.71
A2  (via drill 0.35 pad 0.55)
  Top 0.254: U1.4 41.87,61.18 v41.91,61.21 | S2.5 v49.28,76.71
  Bottom 0.254: v41.91,61.21 41.91,75.95 42.67,76.71 v49.28,76.71
A3  (via drill 0.35 pad 0.55)
  Top 0.254: U1.5 41.37,59.97 v40.89,60.45 | S3.5 v37.59,76.71
  Bottom 0.254: v40.89,60.45 40.89,75.95 40.13,76.71 v37.59,76.71
A4  (via drill 0.35 pad 0.55)
  Top 0.254: U1.6 40.87,58.95 v40.13,59.69 | S4.5 v25.91,76.71
  Bottom 0.254: v40.13,59.69 40.13,75.44 39.62,75.95 26.16,75.95 25.91,76.2 v25.91,76.71
A5  (via drill 0.35 pad 0.55)
  Top 0.254: S5.5 v9.91,22.86 | U1.39 38.87,44.18 v38.62,43.92
  Bottom 0.254: v38.62,43.92 38.71,43.82 38.71,25.25 37.85,24.38 10.41,24.38 9.91,23.88 v9.91,22.86
A6  (via drill 0.35 pad 0.55)
  Top 0.254: S6.5 v21.59,22.86 | U1.40 39.37,43 v39.45,42.93
  Bottom 0.254: v39.45,42.93 39.45,24.46 38.61,23.62 22.35,23.62 v21.59,22.86
A7  (via drill 0.35 pad 0.55)
  Top 0.254: U1.42 40.37,42.02 v40.17,41.81 | S7.5 v33.27,22.86
  Bottom 0.254: v33.27,22.86 38.86,22.86 40.14,24.14 40.14,41.78 v40.17,41.81
A8  (via drill 0.35 pad 0.55)
  Top 0.254: U1.43 40.87,41.02 v41.02,40.87 | S8.5 v44.96,22.86
  Bottom 0.254: v44.96,22.86 42.16,22.86 41.02,24 v41.02,40.87
AINCOM
  Top 0.254: C21.2 49.02,67.75 49.02,67.56 49.02,66.29 46.48,63.75 27.43,63.75 23.77,60.1 U4.10 23.77,52.48 23.37,52.07 21.34,52.07 20.32,51.05 20.32,37.85 16,33.53 14.73,33.53 14.29,33.09 C25.2 | 65.79,12.26 IC1.4
  Top 0.508: IC1.1 64.33,14.16 64.52,13.97 64.52,12.7 64.96,12.26 65.79,12.26
  Top 0.813: R23.2 C24.2 | R20.2 C23.2 | R14.2 48.96,67.63 49.02,67.56 | R17.2 C22.2 | C25.2 R26.2 | R33.2 C26.2 | C27.2 R36.2 | C28.2 R39.2
  Top 1.016: 65.53,7.62 65.82,7.9 IC1.4 | X1.2 55.32,85.65 56.39,84.58 56.39,72.39 55.63,71.63 50.23,71.63 R14.2 | X4.2 20.27,85.65 21.34,84.58 21.34,72.9 18.8,70.36 R23.2 | X3.2 31.95,85.65 33.02,84.58 33.02,72.14 31.24,70.36 R20.2 | X2.2 43.64,85.39 44.7,84.33 44.7,72.14 42.93,70.36 R17.2 | X5.2 15.54,13.92 14.29,15.17 R26.2 | X6.2 27.23,13.67 26.16,14.73 26.16,27.18 28.19,29.21 R33.2 | X7.2 38.91,13.41 37.4,14.92 R36.2 | X8.2 50.6,14.17 49.53,15.24 49.53,26.16 47.82,27.87 R39.2
  Top 1.778: X1.2 55.32,93.27 54.1,94.49 43.69,94.49 | 43.69,94.49 32,94.49 | 32,94.49 20.32,94.49 | 20.32,94.49 20.27,94.44 X4.2 | X3.2 31.95,94.44 32,94.49 | X2.2 43.64,94.44 43.69,94.49 | 15.49,5.08 13.46,5.08 6.6,11.94 6.6,88.39 12.7,94.49 20.32,94.49 | 15.49,5.08 27.43,5.08 | 27.43,5.08 39.12,5.08 | 39.12,5.08 48.51,5.08 | 48.51,5.08 50.6,7.16 X8.2 | X5.2 15.54,5.13 15.49,5.08 | X6.2 27.23,5.28 27.43,5.08 | X7.2 38.91,5.28 39.12,5.08 | 48.51,5.08 62.99,5.08 65.53,7.62
CS_LCD
  Top 0.254: U1.58 50.03,51.8 51.31,53.09 54.08,53.09 SV2.6
CS_SD
  Top 0.254: J2.2 68.19,31.88 67.56,32.51 67.56,36.58 66.8,37.34 51.05,37.34 49.02,39.37 39.62,39.37 37.87,41.12 U1.37
D/C_LCD
  Top 0.254: U1.59 49.51,52.3 51.05,53.85 51.05,55.12 51.54,55.6 SV2.7
GND  (via drill 0.35, 0.35 pad 0.55, 0.45 pad 1.05, 0.55 pad 1.05)
  Top 0.254: v35.56,48.26 35.1,47.8 U1.31 30.28,47.8 30.04,47.56 C9.2 | 35.05,54.36 35.31,54.36 v35.56,54.61 | v38.35,55.12 37.87,55.6 U1.12 37.85,56.77 37.85,57.49 37.85,57.5 37.85,57.66 38.1,57.91 38.61,57.91 38.86,58.17 38.86,60.71 38.61,60.96 37.66,60.96 C6.2 | C19.2 25.73,47.23 U4.22 U4.23 26.42,49.3 26.42,50.29 26.16,50.55 25.4,50.55 | U4.20 24.43,50.34 24.64,50.55 25.4,50.55 | C3.2 47.2,54.3 U1.63 44.4,54.3 v43.94,53.85 43.94,53.09 44.22,52.8 U1.60 | 35.05,54.36 35.05,55.88 34.74,56.2 C4.2 29.46,56.2 | 25.4,50.55 v25.4,52.32 25.4,52.83 25.91,53.34 27.18,53.34 27.69,53.85 U4.4 27.69,55.88 28,56.2 29.46,56.2 | C5.2 42.87,43.55 U1.47 42.87,46.26 v42.37,46.76 | C12.2 78.58,76.23 X9.GND 80.52,76.35 80.52,77.79 X9.CGND5 | IC3.5 68.7,73.99 68.33,74.37 v68.33,74.42 | 33.81,41.37 C8.2 | S11.B2 10.62,39.62 v12.45,39.62 | S13.B2 10.62,47.5 v12.45,47.5 | S14.B2 12.41,55.34 v12.45,55.37 | S12.B2 10.62,63.25 v12.45,63.25 | U1.18 35,54.3 35.05,54.36 | 29.46,56.2 v29.46,56.9
  Top 0.406: U5.2 66.04,56.13 65.79,56.39 65.79,57.66 66.8,58.67 66.8,59.69 | 33.81,41.37 31.92,41.37 U2.4 30.18,41.35 28.96,40.13 28.96,37.31 C31.-
  Top 0.508: C29.2 66.8,59.69 | 66.8,59.69 70.1,59.69 | 70.1,59.69 70.61,59.18 70.61,58.65 C10.- | R28.1 C18.2 67.24,64.96 v67.31,65.02 | C11.2 62.23,60.96 62.74,61.47 | 62.74,61.47 66.29,61.47 66.8,60.96 66.8,59.69 | 70.1,59.69 v71.12,60.71 | S4.6 24.09,72.43 v24.13,72.39 | S3.6 35.77,72.43 v35.81,72.39 | S2.6 46.23,72.98 v46.23,72.9 | S10.6 59.14,72.69 v59.18,72.64 | S5.6 11.68,25.4 v11.68,26.92 | S6.6 23.37,25.4 v23.37,26.92 | S7.6 35.05,25.4 v35.05,26.92 | S8.6 46.78,26.88 v46.74,26.92 | C32.- 45.24,57.43 v44.7,56.9 | J2.6 69.16,27.43 v67.56,27.43 | C17.2 25.4,43.92 C7.- 25.97,44.49 C19.2 25.9,46.91 v24.74,46.91 | C31.- 27.18,36.83 v26.42,37.59 | C2.2 C1.2 | 62.74,61.47 v60.96,61.47 | v63.5,17.78 63.5,16.07 C20.2 62.23,16 61.98,15.75 61.98,13.46 62.23,13.21 IC1.2 | v70.1,17.78 70.1,16.07 C30.2 68.83,16 68.58,15.75 68.58,13.46 68.83,13.21 IC2.2 | R31.2 60.52,10.16 v62.23,10.16 | v19.3,52.32 v19.3,47.5 | C2.2 62.23,33.34 62.23,34.04 v60.45,35.81 | C2.2 62.3,34.05 v62.99,34.75
  Top 0.813: C13.2 C12.2 v78.23,77.98 80.71,77.98 X9.CGND5 80.76,87.89 78.99,89.66 73.41,89.66 | X9.CGND4 83.31,78.49 X9.CGND3 X9.CGND2 83.31,71.37 | 83.31,71.37 X9.CGND1 | 81.22,71.37 83.31,71.37 | X9.CGND6 80.77,71.82 | v80.77,69.85 80.77,71.12 80.71,71.05 C14.2 C15.2 R9.1 v73.15,72.9 | S9.1 77.65,47.93 v77.72,48.01 | J3.2 v69.85,10.92 | SV1.1 61.21,49.53 60.45,50.29 60.45,51.56 | C16.2 60.77,53.15 60.45,52.83 60.45,51.56 | R6.2 v64.26,51.75 60.64,51.75 60.45,51.56 | SV2.2 50.83,42.9 v50.8,42.93 | CN1.2 65.8,89.17 66.29,89.66 73.41,89.66 | CN2.2 73.93,89.14 73.41,89.66
  Top 1.016: X9.CGND5 81.22,78.49 83.31,78.49
  other vias: 3.56,23.11 12.45,18.29 13.21,8.38 18.03,31.24 21.34,35.81 28.19,31.5 34.8,32.77 42.42,33.27 42.42,27.94 48.01,33.27 52.83,6.86 52.58,18.29 58.42,19.56 61.21,20.07 58.42,26.42 74.42,18.54 51.82,33.78 53.59,27.69 57.91,33.78 29.97,38.61 60.96,26.42 64.52,38.86 47.24,48.77 51.31,49.02 56.64,44.2 27.18,42.42 32.26,42.42 25.65,56.9 13.21,66.29 21.34,62.74 18.03,66.29 3.3,66.29 30.99,66.55 27.94,62.48 34.54,62.48 36.32,66.55 39.12,65.53 43.43,58.67 49.53,64.26 44.7,65.79 50.8,59.18 12.45,80.26 3.56,80.52 18.03,81.28 61.47,81.28 60.96,71.63 60.71,69.34 57.4,61.47 67.82,58.17 72.39,56.9 71.63,53.34 81.79,58.93 64.52,42.67 66.04,48.01 59.69,44.7 84.58,69.09 68.07,82.04 71.12,83.57 71.12,86.36
  pour Bottom: 0.25,100.33 86.61,100.33 86.36,-0.25 0.25,-0.25
  pour Top: 0.25,100.33 86.61,100.33 86.61,-0.25 0,-0.25
MISO_ADC
  Top 0.254: U4.27 28.96,49.28 28.96,51.56 29.72,52.32 29.97,52.32 29.99,52.3 U1.22
MISO_SD  (via drill 0.35)
  Top 0.254: J2.7 66.7,26.38 R2.1 66.23,26.99 66.04,27.18 61.47,27.18 60.96,27.69 v60.96,28.96 | v60.96,30.73 60.96,34.04 58.67,36.32 50.55,36.32 48.51,38.35 39.12,38.35 36.87,40.6 U1.35
  Bottom 0.254: v60.96,30.73 v60.96,28.96
MOSI_ADC
  Top 0.254: U1.23 29.96,51.8 29.62,51.46 U4.28
MOSI_LCD
  Top 0.254: U1.57 50.8,51.3 51.31,51.82 56.13,51.82 56.64,51.31 56.64,48.51 56.11,47.98 SV2.4
MOSI_SD
  Top 0.254: J2.3 69.16,30.73 67.82,30.73 66.23,32.32 R4.1 66.23,36.39 65.79,36.83 50.8,36.83 48.77,38.86 39.37,38.86 37.37,40.86 U1.36
N$1
  Top 0.254: R1.1 68.01,25.15 69.08,25.15 | 69.08,25.15 J2.8 | J2.1 70.39,32.98 70.87,32.51 70.87,25.65 70.36,25.15 69.08,25.15
N$3
  Top 0.406: LED4.C 68.99,49.85 R6.1
N$4
  Top 0.254: U4.12 22.48,60.83 26.92,65.28 37.85,65.28 38.61,66.04 38.61,67.75 C22.1
  Top 0.813: C22.1 R17.1 38.67,73.15 R16.1 40.96,73.22 S2.3
N$5
  Top 1.016: X1.1 50.32,80.22 R5.2
N$8
  Top 0.254: R7.2 68.39,75.18 69.85,75.18 70.1,74.93 IC3.3
N$9
  Top 0.254: R9.2 72.58,69.15 71.88,69.85 71.88,70.61 71.12,71.37 69.34,71.37 69.09,71.12 69.09,69.78 IC3.6
N$10
  Top 0.254: R10.2 68.07,71.37 68.33,71.12 68.33,68.83 68.58,68.58 69.34,68.58 69.6,68.84 IC3.7
N$11
  Top 0.254: R7.1 69.75,78.42 LED3.C
N$12
  Top 0.254: R8.1 65.09,79.06 66.04,80.01 71.12,80.01 71.63,79.5 LED1.C
N$13
  Top 0.254: R8.2 68.26,72.64 69.34,72.64 69.6,72.91 IC3.4
N$14
  Top 0.254: R10.1 64.01,71.37 63.75,71.63 63.75,78.74 65.79,80.77 72.39,80.77 73.41,79.76 LED2.C
N$15
  Top 0.254: IC3.8 70.1,68.58 69.6,68.07 68.33,68.07 66.55,69.85 63.75,69.85 62.99,70.61 62.99,78.99 68.83,84.84 74.93,84.84 75.95,85.85 75.95,87.87 CN2.1
N$16
  Top 0.254: X9.VBUS 78.58,73.63 C12.1 | C13.1 75.44,73.98 73.41,73.98 | 73.41,73.98 71.12,73.98 IC3.1 IC3.2 | LED3.A LED1.A LED2.A 73.41,73.98
  Top 0.813: C12.1 75.44,73.98
N$17
  Top 0.254: C21.1 46.9,67.66 46.99,67.56 46.99,65.53 45.97,64.52 27.18,64.52 23.11,60.45 U4.11
  Top 0.813: C21.1 R14.1 47.06,71.69 47.5,72.14 48.51,72.14 49.6,73.22 R11.1 52.65,73.22 S10.3
N$18
  Top 0.813: R15.1 38.61,76.71 | 38.61,76.71 R16.2 | S2.2 38.61,76.71
N$19
  Top 0.508: C29.1 64.56,59.41 U5.4
N$20
  Top 0.813: R11.2 50.29,76.71 | 50.29,76.71 R5.1 | S10.2 50.29,76.71
N$21
  Top 0.813: R21.1 15.24,76.71 | 15.24,76.71 R22.2 | S4.2 15.24,76.71
N$22
  Top 0.254: U4.16 21.82,37.62 25.91,33.53 31.75,33.53 32.26,33.02 32.26,31.82 C26.1
  Top 0.508: 32.26,29.14 R33.1
  Top 0.813: C26.1 R33.1 | 32.26,29.14 R32.1 29.9,26.35 S6.3
N$23
  Top 0.254: U4.17 22.48,37.72 26.16,34.04 38.86,34.04 39.37,33.53 39.37,31.82 C27.1
  Top 0.813: C27.1 R36.1 39.3,26.65 39.61,26.35 | S7.3 39.61,26.35 | R35.1 39.61,26.35
N$24
  Top 1.016: X2.1 38.63,80.35 R15.2
N$25
  Top 0.254: R28.2 47.82,63.06 46.99,62.23 36.83,62.23 36.37,61.77 U1.15
  Top 0.813: R13.2 64.84,62.99 C18.1 R28.2
N$29
  Top 0.254: U4.13 21.82,61.19 26.99,66.36 C23.1
  Top 0.813: C23.1 R20.1 26.99,73.15 R19.1 29.28,73.22 S3.3
N$30
  Top 0.508: IC2.1 70.68,14.16 71.12,13.72 71.12,12.7 71.56,12.26 IC2.4 72.42,12.19 72.39,12.16
  Top 0.813: J3.1 72.39,12.16
N$31
  Top 0.254: C19.1 27.69,47.18 U4.25 U4.24
  Top 0.813: R42.2 C7.+ 28.68,46.19 C19.1
N$32
  Top 0.813: 26.95,80.22 R18.2
  Top 1.016: X3.1 26.95,80.22
N$33
  Top 0.254: IC3.9 70.61,69.77 | 70.61,69.77 IC3.10 71.12,69.75 71.12,68.58 72.14,67.56 75.18,67.56 75.69,68.07 C15.1 | 70.61,69.77 70.61,67.82 70.1,67.31 68.07,67.31 66.29,69.09 63.5,69.09 62.23,70.36 62.23,79.25 67.8,84.82 CN1.1
  Top 0.813: C15.1 C14.1 81.2,66.18 S1.1 81.28,63.17 81.28,61.47 80.06,60.25 80.06,59.18 | T1.3 80.06,59.18 | R29.1 80.06,59.18
N$34
  Top 0.813: R18.1 26.92,76.45 | 26.92,76.45 R19.2 | S3.2 30.02,76.45 26.92,76.45
N$35
  Top 0.508: IC1.3 61.21,12.26 60.58,12.26 R31.1 R30.2
N$36  (via drill 0.35 pad 0.55)
  Top 0.254: v15.49,41.91 15.49,36.07 14.48,35.05 10.62,35.05 S11.A2 | U1.29 31.28,48.8 v31.24,48.77
  Bottom 0.254: v31.24,48.77 17.53,48.77 16.51,47.75 16.51,42.93 v15.49,41.91
N$37
  Top 0.254: U4.14 21.18,61.11 14.99,67.31 14.99,67.75 C24.1
  Top 0.813: C24.1 R23.1 15.24,70.42 R22.1 17.6,73.22 S4.3
N$39
  Top 0.254: C25.1 16.26,31.82 16.26,32.77 21.18,37.69 U4.15
  Top 0.813: C25.1 R26.1 17.23,28.17 17.23,26.42 | 17.23,26.42 S5.3 | R25.1 17.29,26.35 17.23,26.42
N$40
  Top 0.813: 15.27,80.22 R21.2
  Top 1.016: X4.1 15.27,80.22
N$43  (via drill 0.35, 0.35 pad 0.55)
  Top 0.254: U1.26 31.25,50.3 v31.24,50.29 | v15.49,50.29 11.12,50.29 S14.A2
  Bottom 0.254: v31.24,50.29 v15.49,50.29
N$44
  Top 0.813: 20.57,9.93 X5.1
  Top 1.016: R24.2 20.57,9.93
N$46
  Top 0.813: R25.2 20.57,22.86 | 20.57,22.86 R24.1 | S5.2 20.57,22.86
N$47  (via drill 0.35, 0.35 pad 0.55)
  Top 0.254: U1.27 32.79,49.8 v32.51,49.53 | v15.49,48.26 15.49,43.94 14.48,42.93 10.62,42.93 S13.A2
  Bottom 0.254: v32.51,49.53 16.76,49.53 v15.49,48.26
N$48
  Top 0.508: 76.2,59.37 R29.2
  Top 0.813: R12.2 74.42,65.53 76.2,63.75 76.2,59.37 | R29.2 76.01,57.08 76.96,56.13 76.96,52.83 78,51.79 T1.1
N$49
  Top 0.254: S9.2 67.31,45.97 66.8,45.47 66.8,43.18 61.47,37.85 51.31,37.85 49.28,39.88 43.18,39.88 41.37,41.68 U1.44
N$50
  Top 0.813: 32.26,9.93 X6.1
  Top 1.016: R27.2 32.26,9.93
N$51
  Top 0.813: R32.2 32.26,22.86 | 32.26,22.86 R27.1 | S6.2 32.26,22.86
N$52  (via drill 0.35, 0.35 pad 0.55)
  Top 0.254: U1.25 32.7,50.8 v32.46,51.05 | v15.49,52.32 15.49,57.91 14.7,58.71 S12.A2
  Bottom 0.254: v32.46,51.05 16.77,51.05 v15.49,52.32
N$54
  Top 0.813: 43.94,9.93 X7.1
  Top 1.016: R34.2 43.94,9.93
N$55
  Top 0.813: R35.2 43.94,22.86 | 43.94,22.86 R34.1 | S7.2 43.94,22.86
N$56
  Top 0.254: U4.18 23.11,37.85 26.42,34.54 48.51,34.54 49.78,33.27 49.78,31.82 C28.1
  Top 0.813: C28.1 R39.1 52.28,26.39 | 52.28,26.39 S8.3 | R38.1 52.32,26.35 52.28,26.39
N$58
  Top 0.813: 55.63,9.93 X8.1
  Top 1.016: R37.2 55.63,9.93
N$59
  Top 0.813: R38.2 55.63,23.11 | 55.63,23.11 R37.1 | S8.2 55.37,22.86 55.63,23.11
N$60
  Top 0.254: 33.94,39.78 C8.1
  Top 0.406: U2.2 33.67,40.06 33.94,39.78
  Top 0.508: R46.2 34.29,36.98 34.04,36.98
  Top 0.813: C8.1 34.04,36.98 33.88,36.83 C31.+
POWER
  Top 0.254: R12.1 68.65,66.55 67.82,66.55 66.04,68.33 63.25,68.33 61.21,70.36 51.31,70.36 50.29,69.34 50.29,66.55 46.74,62.99 36.83,62.99 35.87,62.04 U1.16
RESET_LCD
  Top 0.254: U1.61 49.49,53.3 50.29,54.1 50.29,56.9 51.56,58.17 54.08,58.17 SV2.8
SCK_ADC
  Top 0.254: U1.21 28.98,52.8 28.32,53.47 U4.3
SCK_LCD
  Top 0.254: U1.55 53.88,50.3 SV2.5
SCK_SD
  Top 0.254: J2.5 69.08,28.45 R3.1 66.23,29.28 65.79,29.72 60.71,29.72 60.2,30.23 60.2,34.04 58.42,35.81 50.29,35.81 48.26,37.85 38.86,37.85 36.37,40.33 U1.34
SWDCLK
  Top 0.254: U1.49 46.17,47.3 46.74,46.74 46.74,43.94 51.82,38.86 60.2,38.86 60.96,39.62 60.96,46.23 61.72,46.99 SV1.2
SWDIO
  Top 0.254: U1.46 42.37,44.41 41.91,43.94 41.91,41.91 43.43,40.39 49.53,40.39 51.56,38.35 60.96,38.35 63.5,40.89 SV1.3
V_BAT
  Top 0.508: T1.4 73.91,54.15 73.91,54.86 73.66,54.86 | C10.+ 70.15,55.18 68.83,55.18 | 68.83,55.18 U5.1 | U5.3 67.08,57.15 68.33,57.15 68.83,56.64 68.83,55.18
  Top 0.813: T1.4 73.86,50.85 74.93,49.78 81.53,49.78 82.3,50.55 82.3,53.34 81.53,54.1 T1.2 | C10.+ 73.38,55.4 73.91,54.86 | R13.1 69.53,63.25 S1.2 73.66,61.8 73.66,54.86
VREF
  Top 0.254: 25.65,39.7 25.41,39.7 C17.1 23.84,39.69 23.77,39.62 | U4.19 23.77,39.62 | 23.77,39.62 23.77,37.95 26.67,35.05 58.42,35.05 59.69,33.78 59.69,18.8 | IC2.3 68.51,12.26 67.82,12.95 67.82,17.78 66.8,18.8 59.69,18.8 | R30.1 60.45,17.27 59.69,18.03 59.69,18.8
  Top 0.406: U2.6 26.5,40.72 26.32,40.53 26.31,40.53 25.65,39.88 25.65,39.7
ZAS
  Top 0.254: 37.37,54.39 36.87,54.39 36.32,53.85 | 36.32,53.85 36.28,53.8 U1.19 32.3,53.8 32.13,53.98 32.13,54.17 C4.1 | 36.32,53.85 36.32,48.01 36.58,47.75 | 36.58,47.75 36.83,47.5 42.67,47.5 42.8,47.62 | 42.8,47.62 43.18,48.01 43.18,53.59 42.67,54.1 | 42.67,54.1 42.38,54.39 37.37,54.39 | 42.67,54.1 43.37,54.8 U1.64 45.32,55.99 45.83,56.5 C3.1 | 36.58,47.75 36.13,47.3 U1.32 33.86,47.24 32.26,47.24 31.94,46.92 C9.1 | 42.8,47.62 43.37,47.05 U1.48 44.56,45.35 45.15,44.77 C5.1 | C6.1 37.37,58.9 U1.13 37.37,54.39
  Top 0.813: R47.1 50.01,61.21 C32.+ 48.24,57.24 C3.1